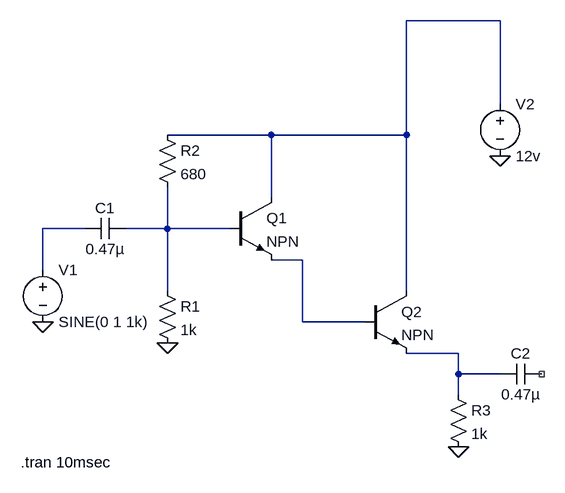
[diagram p0: schematic exp_7_i_woutb_electro.asc]
exp_7_i_woutb_electro.asc, the LTspice schematic file:
Version 4
SHEET 1 880 680
WIRE 752 -176 608 -176
WIRE 752 -48 752 -176
WIRE 400 0 240 0
WIRE 608 0 608 -176
WIRE 608 0 400 0
WIRE 400 96 400 0
WIRE 112 144 48 144
WIRE 240 144 240 80
WIRE 240 144 176 144
WIRE 336 144 240 144
WIRE 448 192 400 192
WIRE 48 208 48 144
WIRE 240 240 240 144
WIRE 608 240 608 0
WIRE 448 288 448 192
WIRE 544 288 448 288
WIRE 688 336 608 336
WIRE 688 368 688 336
WIRE 752 368 688 368
WIRE 688 400 688 368
FLAG 752 32 0
FLAG 688 480 0
FLAG 240 320 0
FLAG 48 288 0
SYMBOL voltage 48 192 R0
WINDOW 123 0 0 Left 0
WINDOW 39 0 0 Left 0
SYMATTR InstName V1
SYMATTR Value SINE(0 1 1k)
SYMBOL cap 176 128 R90
WINDOW 0 0 32 VBottom 2
WINDOW 3 32 32 VTop 2
SYMATTR InstName C1
SYMATTR Value 0.47µ
SYMBOL res 224 224 R0
SYMATTR InstName R1
SYMATTR Value 1k
SYMBOL res 224 -16 R0
SYMATTR InstName R2
SYMATTR Value 680
SYMBOL npn 336 96 R0
SYMATTR InstName Q1
SYMBOL voltage 752 -64 R0
WINDOW 123 0 0 Left 0
WINDOW 39 0 0 Left 0
SYMATTR InstName V2
SYMATTR Value 12v
SYMBOL res 672 384 R0
SYMATTR InstName R3
SYMATTR Value 1k
SYMBOL cap 816 352 R90
WINDOW 0 0 32 VBottom 2
WINDOW 3 32 32 VTop 2
SYMATTR InstName C2
SYMATTR Value 0.47µ
SYMBOL npn 544 240 R0
SYMATTR InstName Q2
TEXT 14 504 Left 2 !.tran 10msec

The netlist it stands for:
* exp_7_i_woutb_electro.asc
V1 N002 0 SINE(0 1 1k)
C1 N003 N002 0.47µ
R1 N003 0 1k
R2 N001 N003 680
Q1 N001 N003 N004 0 NPN
V2 N001 0 12v
R3 N005 0 1k
C2 NC_01 N005 0.47µ
Q2 N001 N004 N005 0 NPN
.model NPN NPN
.model PNP PNP
.lib standard.bjt
.tran 10msec
.backanno
.end